# Altium schematic sheet Sheet2.SchDoc
size A4
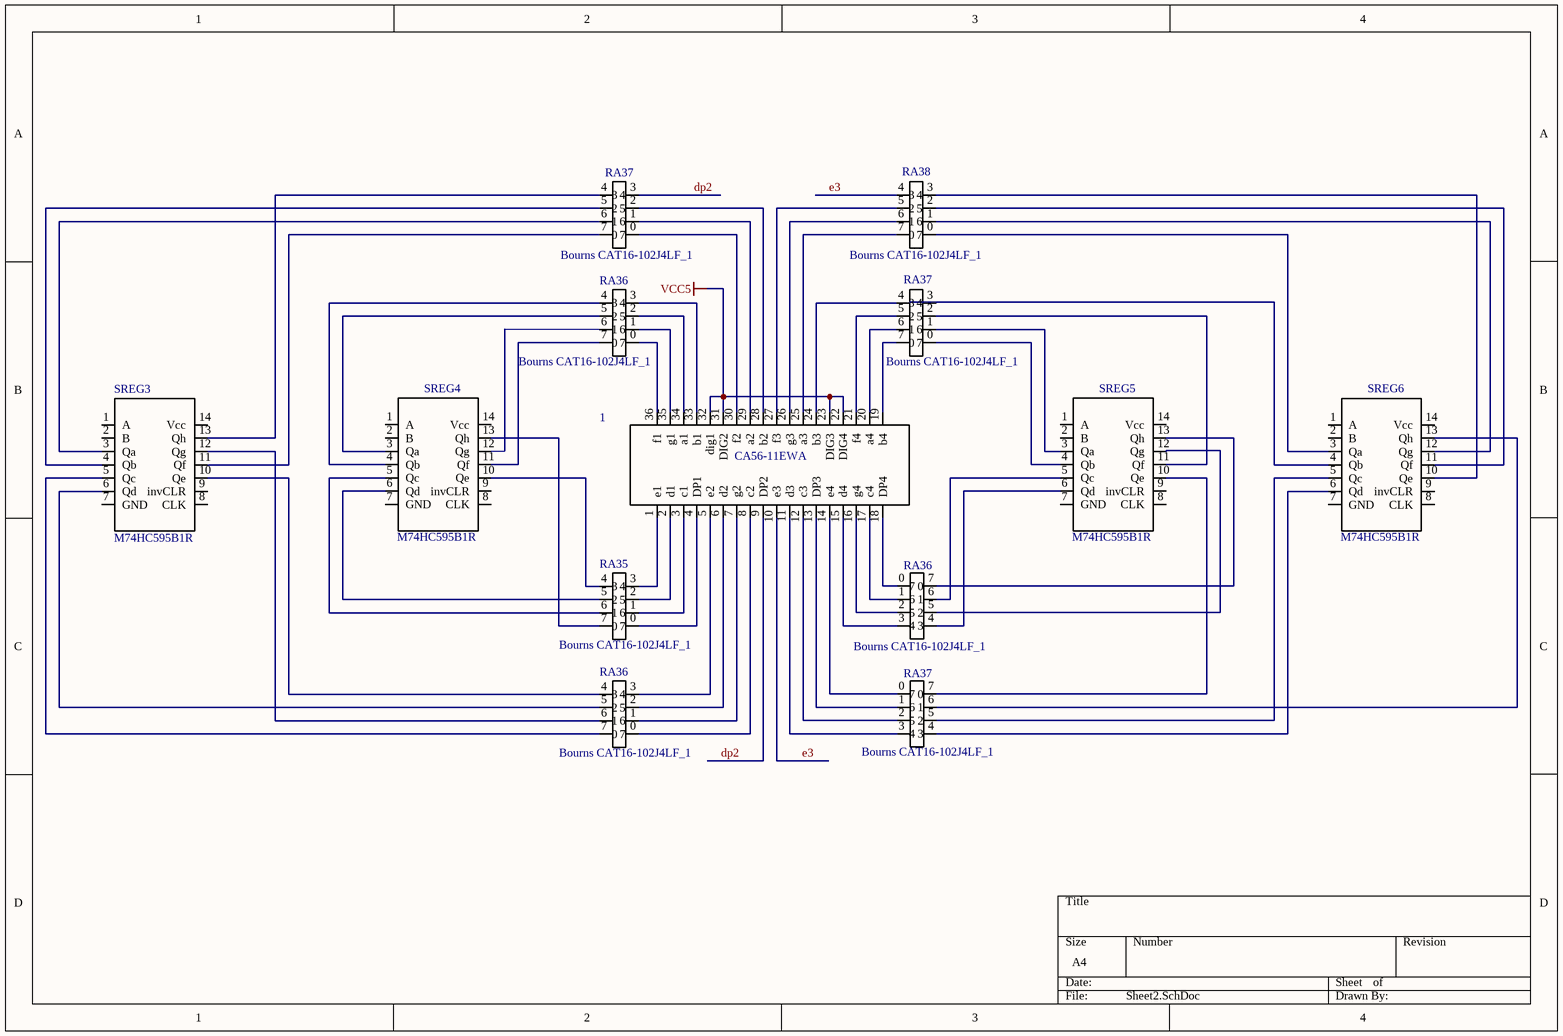
[diagram p0: Sheet2.SchDoc]

## Parts
(Parts that share a designator on the sheet are numbered #1, #2 ... from top to bottom, then left to right.)
1  CA56-11EWA  [CA56-11EWA]
RA35  Bourns CAT16-102J4LF_1  [CAT16-102J4LF_2]
RA36#1  Bourns CAT16-102J4LF_1  [CAT16-102J4LF_2]
RA36#2  Bourns CAT16-102J4LF_1  [CAT16-102J4LF_2]
RA36#3  Bourns CAT16-102J4LF_1  [CAT16-102J4LF_2]
RA37#1  Bourns CAT16-102J4LF_1  [CAT16-102J4LF_2]
RA37#2  Bourns CAT16-102J4LF_1  [CAT16-102J4LF_2]
RA37#3  Bourns CAT16-102J4LF_1  [CAT16-102J4LF_2]
RA38  Bourns CAT16-102J4LF_1  [CAT16-102J4LF_2]
SREG3  M74HC595B1R  [SN74HC164DR-D]
SREG4  M74HC595B1R  [SN74HC164DR-D]
SREG5  M74HC595B1R  [SN74HC164DR-D]
SREG6  M74HC595B1R  [SN74HC164DR-D]

## Nets
VCC5: 1.22(DIG4) 1.23(DIG3) 1.31(DIG2) 1.32(dig1)
dp2: 1.9(DP2) RA37#1.3
e3: 1.10(e3) RA38.4
Net1_1: 1.1(e1) RA35.3
Net1_2: 1.2(d1) RA35.2
Net1_3: 1.3(c1) RA35.1
Net1_4: 1.4(DP1) RA35.0
Net1_5: 1.5(e2) RA36#3.3
Net1_6: 1.6(d2) RA36#3.2
Net1_7: 1.7(g2) RA36#3.1
Net1_8: 1.8(c2) RA36#3.0
Net1_11: 1.11(d3) RA37#3.3
Net1_12: 1.12(c3) RA37#3.2
Net1_13: 1.13(DP3) RA37#3.1
Net1_14: 1.14(e4) RA37#3.0
Net1_15: 1.15(d4) RA36#2.3
Net1_16: 1.16(g4) RA36#2.2
Net1_17: 1.17(c4) RA36#2.1
Net1_18: 1.18(DP4) RA36#2.0
Net1_19: 1.19(b4) RA37#2.7
Net1_20: 1.20(a4) RA37#2.6
Net1_21: 1.21(f4) RA37#2.5
Net1_24: 1.24(b3) RA37#2.4
Net1_25: 1.25(a3) RA38.7
Net1_26: 1.26(g3) RA38.6
Net1_27: 1.27(f3) RA38.5
Net1_28: 1.28(b2) RA37#1.2
Net1_29: 1.29(a2) RA37#1.1
Net1_30: 1.30(f2) RA37#1.0
Net1_33: 1.33(b1) RA36#1.3
Net1_34: 1.34(a1) RA36#1.2
Net1_35: 1.35(g1) RA36#1.1
Net1_36: 1.36(f1) RA36#1.0
NetRA35_4: RA35.4 SREG4.10(Qe)
NetRA35_5: RA35.5 SREG4.6(Qd)
NetRA35_6: RA35.6 SREG4.5(Qc)
NetRA35_7: RA35.7 SREG4.13(Qh)
NetRA36#1_4: RA36#1.4 SREG4.4(Qb)
NetRA36#1_5: RA36#1.5 SREG4.3(Qa)
NetRA36#1_6: RA36#1.6 SREG4.12(Qg)
NetRA36#1_7: RA36#1.7 SREG4.11(Qf)
NetRA36#2_4: RA36#2.4 SREG5.6(Qd)
NetRA36#2_5: RA36#2.5 SREG5.12(Qg)
NetRA36#2_6: RA36#2.6 SREG5.5(Qc)
NetRA36#2_7: RA36#2.7 SREG5.13(Qh)
NetRA36#3_4: RA36#3.4 SREG3.10(Qe)
NetRA36#3_5: RA36#3.5 SREG3.6(Qd)
NetRA36#3_6: RA36#3.6 SREG3.12(Qg)
NetRA36#3_7: RA36#3.7 SREG3.5(Qc)
NetRA37#1_4: RA37#1.4 SREG3.13(Qh)
NetRA37#1_5: RA37#1.5 SREG3.4(Qb)
NetRA37#1_6: RA37#1.6 SREG3.3(Qa)
NetRA37#1_7: RA37#1.7 SREG3.11(Qf)
NetRA37#2_0: RA37#2.0 SREG5.4(Qb)
NetRA37#2_1: RA37#2.1 SREG5.3(Qa)
NetRA37#2_2: RA37#2.2 SREG5.11(Qf)
NetRA37#3_4: RA37#3.4 SREG6.6(Qd)
NetRA37#3_5: RA37#3.5 SREG6.5(Qc)
NetRA37#3_6: RA37#3.6 SREG6.13(Qh)
NetRA37#3_7: RA37#3.7 SREG5.10(Qe)
NetRA38_0: RA38.0 SREG6.3(Qa)
NetRA38_1: RA38.1 SREG6.12(Qg)
NetRA38_2: RA38.2 SREG6.11(Qf)
NetRA38_3: RA38.3 SREG6.10(Qe)

Not connected (* = marked no-connect by the designer): RA37#2 3; SREG3 1(A) 2(B) 7(GND) 8(CLK) 9(invCLR) 14(Vcc); SREG4 1(A) 2(B) 7(GND) 8(CLK) 9(invCLR) 14(Vcc); SREG5 1(A) 2(B) 7(GND) 8(CLK) 9(invCLR) 14(Vcc); SREG6 1(A) 2(B) 4(Qb) 7(GND) 8(CLK) 9(invCLR) 14(Vcc)